# Altium schematic sheet Sheet2.SchDoc
size A4; SheetNumber: 2; SheetTotal: 2
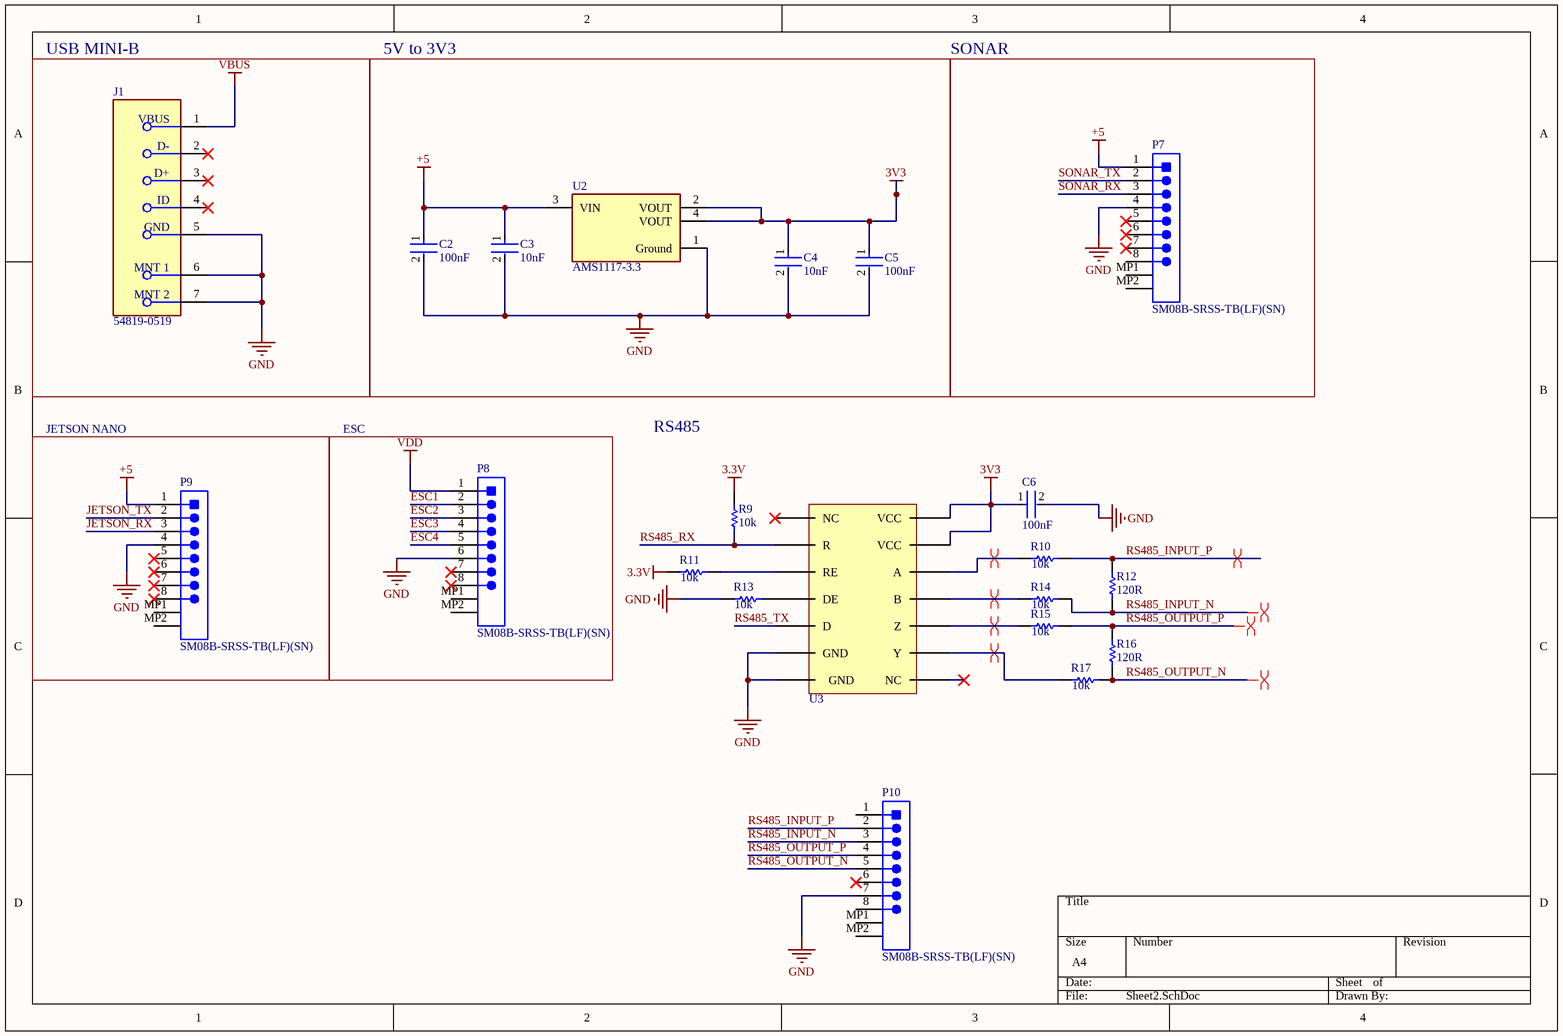
[diagram p0: Sheet2.SchDoc]

## Parts
C2  100nF  [FP-C0402-BB-MFG]
C3  10nF  [FP-C0402-BB-MFG]
C4  10nF  [FP-C0402-BB-MFG]
C5  100nF  [FP-C0402-BB-MFG]
C6  100nF  [FP-C0402-BB-MFG]
J1  54819-0519  [FP-54819-0519-MFG]
P7  SM08B-SRSS-TB(LF)(SN)  [JST-SM08B-SRSS-TB_V]
P8  SM08B-SRSS-TB(LF)(SN)  [JST-SM08B-SRSS-TB_V]
P9  SM08B-SRSS-TB(LF)(SN)  [JST-SM08B-SRSS-TB_V]
P10  SM08B-SRSS-TB(LF)(SN)  [JST-SM08B-SRSS-TB_V]
R9  10k  [RESC1609X50X30LL8T20]
R10  10k  [RESC1609X50X30LL8T20]
R11  10k  [RESC1609X50X30LL8T20]
R12  120R  [RESC1609X50X30LL8T20]
R13  10k  [RESC1609X50X30LL8T20]
R14  10k  [RESC1609X50X30LL8T20]
R15  10k  [RESC1609X50X30LL8T20]
R16  120R  [RESC1609X50X30LL8T20]
R17  10k  [RESC1609X50X30LL8T20]
U2  AMS1117-3.3  [FP-AMS1117-IPC_C]
U3  SN65HVD1473D  [SOIC127P600X175-14N]  (value not drawn)

## Blocks framed on the sheet
USB MINI-B: J1
5V to 3V3: C2-C5 U2
SONAR: P7
JETSON NANO: P9
ESC: P8

## Nets
3.3V: R9.2 R11.1
3V3: C4.1 C5.1 C6.1 U2.2(VOUT) U2.4(VOUT) U3.16(VCC) U3.22(VCC)
+5: C2.1 C3.1 P7.1 P9.1 U2.3(VIN)
GND: C2.2 C3.2 C4.2 C5.2 C6.2 J1.5(GND) J1.6(MNT_1) J1.7(MNT_2) P7.4 P8.6 P9.4 P10.7 R13.1 U2.1(Ground) U3.11(GND) U3.12(GND)
VBUS: J1.1(VBUS)
VDD: P8.1
ESC1: P8.2
ESC2: P8.3
ESC3: P8.4
ESC4: P8.5
JETSON_RX: P9.3
JETSON_TX: P9.2
RS485_INPUT_N: P10.3 R12.1 R14.2
RS485_INPUT_P: P10.2 R10.2 R12.2
RS485_OUTPUT_N: P10.5 R16.1 R17.2
RS485_OUTPUT_P: P10.4 R15.2 R16.2
RS485_RX: R9.1 U3.R
RS485_TX: U3.13(D)
SONAR_RX: P7.3
SONAR_TX: P7.2
NetR10_1: R10.1 U3.21(A)
NetR11_2: R11.2 U3.15(RE)
NetR13_2: R13.2 U3.14(DE)
NetR14_1: R14.1 U3.20(B)
NetR15_1: R15.1 U3.19(Z)
NetR17_1: R17.1 U3.18(Y)

Not connected (* = marked no-connect by the designer): J1 2(D-)* 3(D+)* 4(ID)*; P7 5* 6* 7* 8 MP1 MP2; P8 7* 8* MP1 MP2; P9 5* 6* 7* 8* MP1 MP2; P10 1 6* 8 MP1 MP2; U3 9(NC)* 17(NC)*

## Layout directives
differential pair; differential pair class diff100: NetR10_1, NetR14_1
differential pair; differential pair class diff101: NetR15_1, NetR17_1
differential pair; differential pair class diff103: RS485_OUTPUT_N, RS485_OUTPUT_P
differential pair; differential pair class diff102: RS485_INPUT_N, RS485_INPUT_P

## Notes on the sheet
- RS485

## Library data of the parts
C2-C6 = CMP-2008-02046-2: CAP CER 0.1UF 10V X5R 0402; Manufacturer: Kemet; Manufacturer Part Number: C0402C104K8PACTU; Material: Ceramic; Capacitance: 0.10 μF; Temperature Coefficient: 15%; Tolerance: 0.1; Value: 0.10 μF; Package: C0402-BB; Temperature: -55°C to +125°C; ComponentLink2Description: Datasheet; Temperature Characteristic: X5R; Device Class L1: Passive Components; Height: 0.55mm; Lead Free: Yes; ComponentLink2URL: https://content.kemet.com/datasheets/KEM_C1002_X7R_SMD.pdf; Device Class L2: Capacitors; Temperature Range Low: -55°C; Temperature Range High: +125°C; RoHS: TRUE; Octopart: https://octopart.com/c0402c104k8pactu-kemet-140039; Automotive: No; Mouser Description: Capacitor 100 nF 10 VDC 0402; Category: Cap; Voltage Rating: 10 V; Digikey Description: CAP CER 0.1UF 10V X5R 0402; Ipc Land Pattern Name: CAPC10050X50; Device Class L3: Ceramic Capacitors
J1 = CMP-04767-000009-1: CONN RCPT USB2.0 MINI B 5P R/A; Number of Circuits: 5; Max Current Rating: 1A; Pitch: 0.8mm; Contact Resistance: 50mR; Data Rate: 480Mbps; Gender: Receptacle; Number of Ports: 1; Connector Type: USB; Working Voltage: 30V; Insulation Resistance: 100MR; Number of Rows: 1; Series: 54819; USB Standard: USB 2.0; Contact Plating: Gold; Min Operating Temperature: 0°C; Radiation Hardening: No; Current Rating: 1A; Number of Terminals/Pins: 5; Number of Positions: 5; Packaging: Tray; Termination: Solder; Orientation: Right Angle; Flammability Rating: UL94 V-0; Package Quantity: 3600; Number of Contacts: 5; Lead Free: Lead Free; Max Operating Temperature: 50°C; Color: Black; Housing Color: Black; Contact Material: Copper Alloy; Width: 6.9mm; Length: 7.7mm; Housing Material: Polyamide; Features: Shielded; Mount: Through Hole; Voltage Rating: 30V; Depth: 9mm; Voltage Rating (DC): 30V
P7-P10 = CMP-2000-07082-1: Male Header, Pitch 1 mm, 1 x 8 Position, Height 2.95 mm, -25 to 85 degC, RoHS, Tape and Reel; Manufacturer: JST; Style/Orientation: RightAngleHeader/Plug; Pitch: 1mm; No of Positions: 8; Manufacturer URL: http://www.jst.com/home2.html; Mounting Technology: SurfaceMount; Package Description: Male Header, Pitch 1 mm, 1 x 8 Position, Height 2.95 mm; Datasheet URL: http://www.jst-mfg.com/product/pdf/eng/eSR.pdf; Type: ShroudedHeader; Termination: Crimp; Package Reference: SM08B-SRSS-TB; Datasheet Version: 11/2010
R9-R17 = CMP-1666-00005-4: Chip Resistor, 10 KOhm, +/- 1%, 100 mW, -55 to 155 degC, 0603 (1608 Metric), RoHS, Tape and Reel; Manufacturer: Vishay Semiconductor; Voltage Rating: 75 V; Max Operating Temperature: 155 degC; PackageDescription: 2-Pin Surface Mount Device, Body 1.575 x 0.85 mm; ComponentLink1Description: Manufacturer URL; RoHSCompliant: true; PackageReference: 0603; REACH SVHC: Unknown; Length: 1.55 mm; DatasheetVersion: 06/2012; Packaging: Tape and Reel; Min Operating Temperature: -55 degC; Mounting Technology: Surface Mount; ComponentLink2URL: https://datasheet.ciiva.com/11809/0900766b80d98afc-11809037.pdf; Height: 0.45 mm; ComponentLink2Description: Datasheet; Package Quantity: 5000; ComponentLink1URL: http://www.vishay.com/
U2 = CMP-209535-000001-1: LDO Voltage Regulators 1A, 3.3V; Manufacturer: Advanced Monolithic Systems; Dropout Voltage: 1.1V; Output Type: Fixed; Nominal Supply Current: 5mA; Max Power Dissipation: 1.2W; Max Supply Voltage: 15V; Number Of Outputs: 1; Standoff Height: 0.64mm; Max Junction Temp: +125°C; Height: 1.8mm; Package: AMS1117; Device Class L2: Power Management ICs; ComponentLink2Description: Datasheet; ComponentLink2URL: http://www.advanced-monolithic.com/pdf/ds1117.pdf; Category: IC; RoHS: TRUE; Automotive: No; Device Class L1: Integrated Circuits (ICs); Output Current: 1A; Device Class L3: Voltage Regulators - Linear; Temperature: -40°C to +125°C; Output Voltage: 3.3V; Manufacturer Part Number: AMS1117-3.3; Temperature Range Low: -40°C; Octopart: https://octopart.com/ams1117-3.3-advanced+monolithic+systems-25899300; Lead Free: Yes; Ipc Land Pattern Name: SOT229P700X180-4; Temperature Range High: +125°C